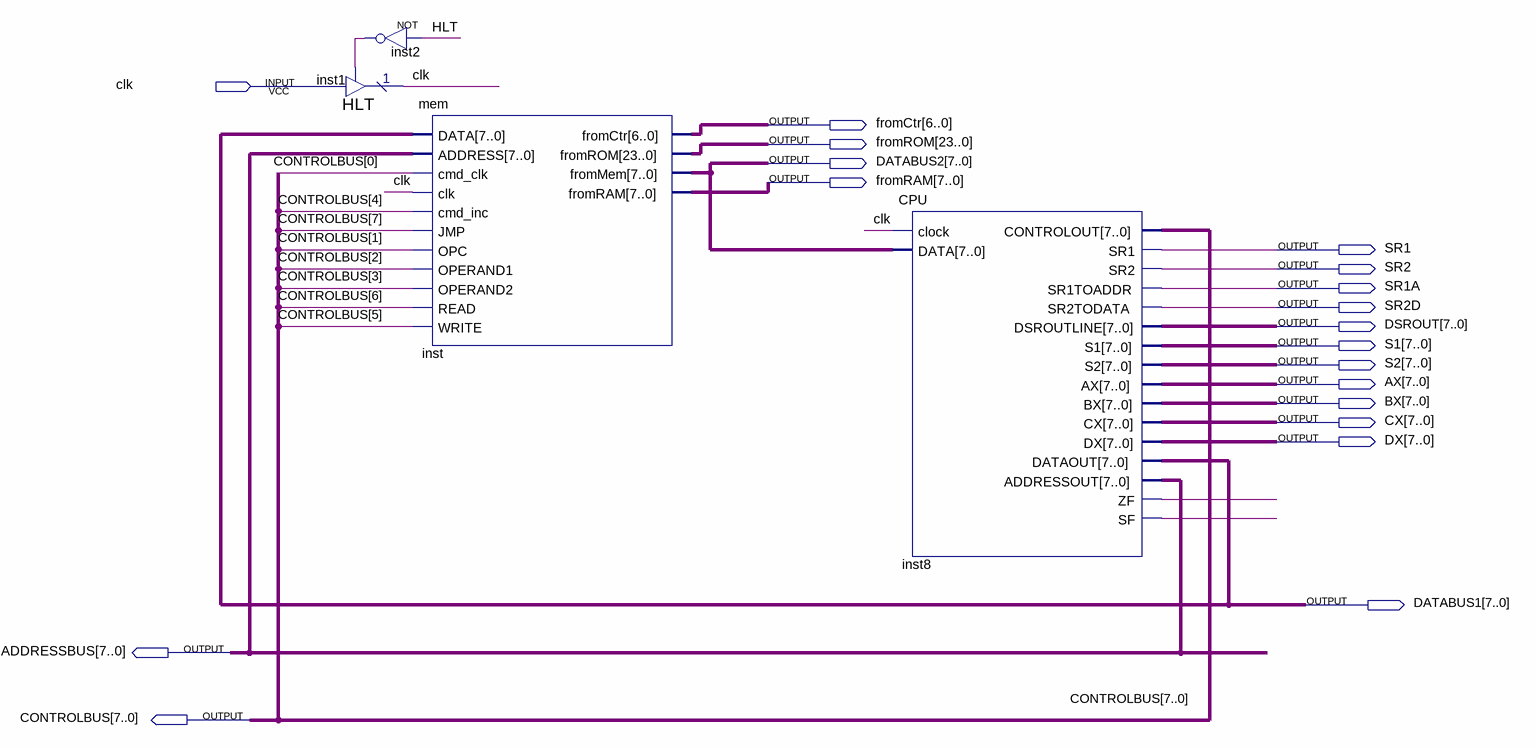
[diagram p0: schematic sheet]
// Quartus schematic proc.bdf as structural Verilog: 4 symbols, 19 pins
module proc (
  input  clk,
  output [6:0] fromCtr,
  output [23:0] fromROM,
  output [7:0] DATABUS2,
  output [7:0] fromRAM,
  output SR1,
  output SR2,
  output SR1A,
  output SR2D,
  output [7:0] DSROUT,
  output [7:0] S1,
  output [7:0] S2,
  output [7:0] AX,
  output [7:0] BX,
  output [7:0] CX,
  output [7:0] DX,
  output [7:0] DATABUS1,
  output [7:0] ADDRESSBUS,
  output [7:0] CONTROLBUS
);

  wire HLT, inst2_out, inst8_sf, inst8_zf;

  not inst2 (inst2_out, HLT);
  HLT inst1 (.enabledt(inst2_out), .data(clk), .tridata(clk));
  mem inst (
    .DATA(DATABUS1), .ADDRESS(ADDRESSBUS), .cmd_clk(CONTROLBUS[0]), .clk(clk), .cmd_inc(CONTROLBUS[4]),
    .JMP(CONTROLBUS[7]), .OPC(CONTROLBUS[1]), .OPERAND1(CONTROLBUS[2]), .OPERAND2(CONTROLBUS[3]),
    .READ(CONTROLBUS[6]), .WRITE(CONTROLBUS[5]), .fromCtr(fromCtr), .fromROM(fromROM), .fromMem(DATABUS2),
    .fromRAM(fromRAM));
  CPU inst8 (
    .clock(clk), .DATA(DATABUS2), .CONTROLOUT(CONTROLBUS), .SR1(SR1), .SR2(SR2), .SR1TOADDR(SR1A),
    .SR2TODATA(SR2D), .DSROUTLINE(DSROUT), .S1(S1), .S2(S2), .AX(AX), .BX(BX), .CX(CX), .DX(DX),
    .DATAOUT(DATABUS1), .ADDRESSOUT(ADDRESSBUS), .ZF(inst8_zf), .SF(inst8_sf));
endmodule
